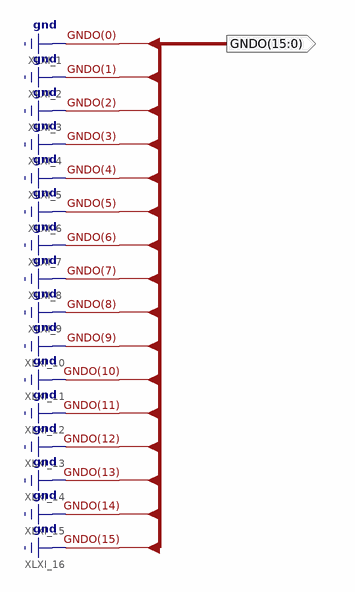
[diagram p0: schematic sheet 1]
// Xilinx ISE schematic gnd16.sch (spartan6) as structural Verilog: 0 symbols, 1 ports
module gnd16 (
  output [15:0] GNDO
);


  assign GNDO = {16{1'b0}};
endmodule
